# Altium schematic sheet 原理图.SchDoc
size A4; SheetNumber: 0; SheetTotal: 0
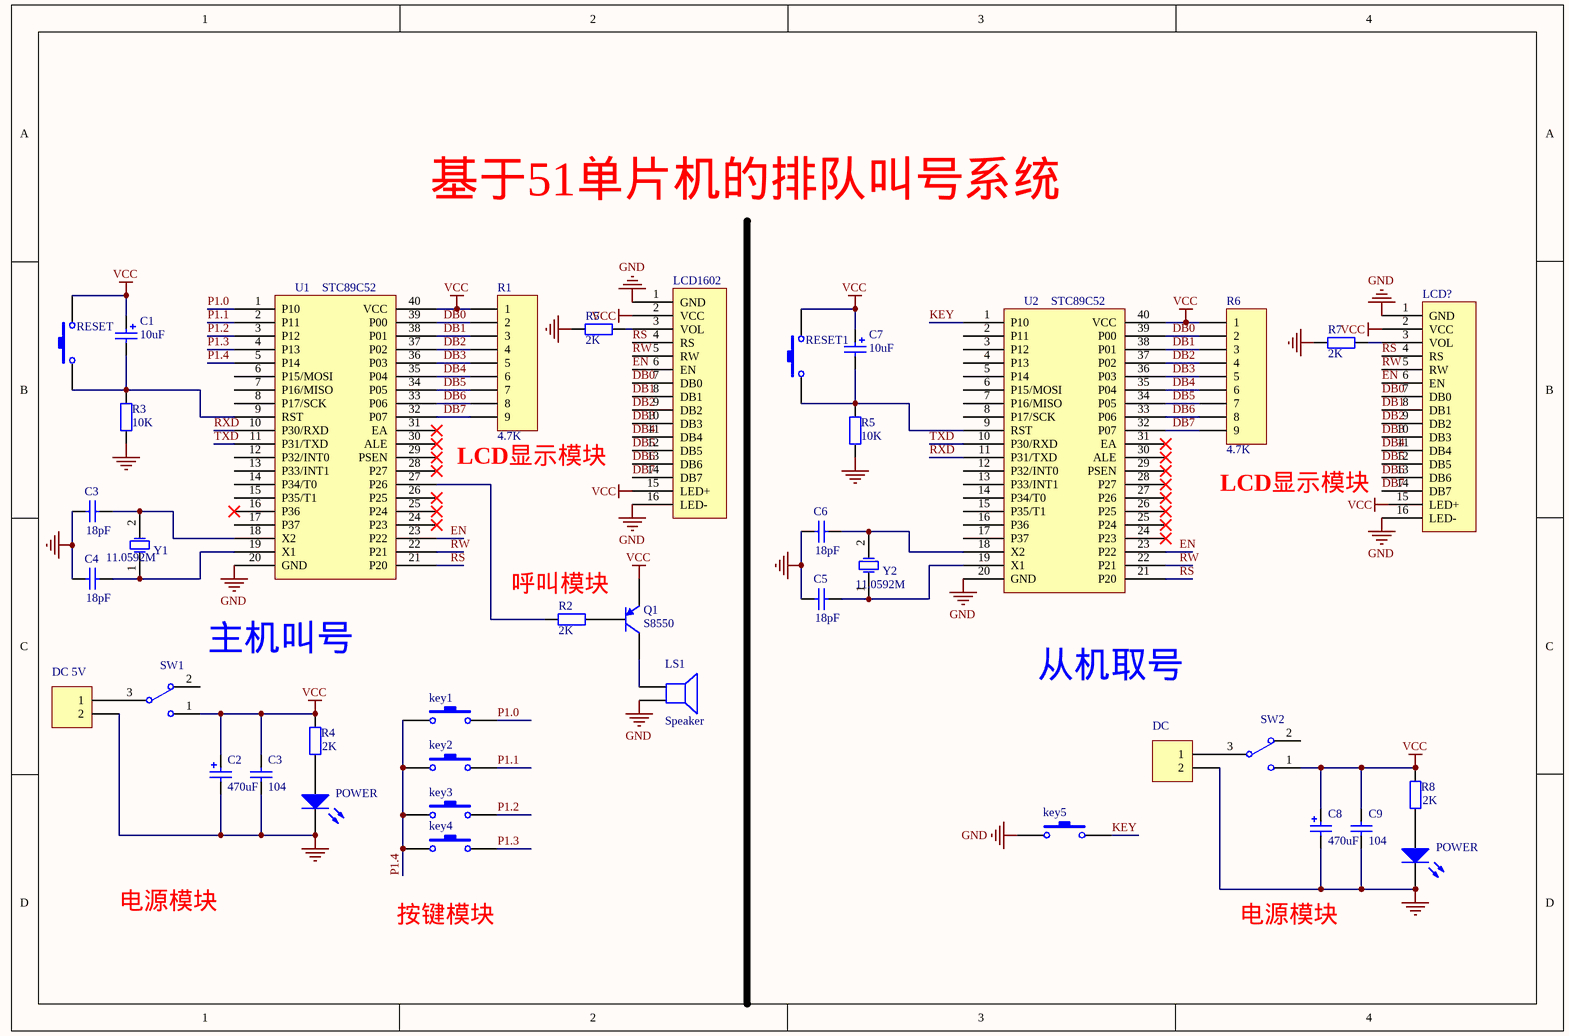
[diagram p0: 原理图.SchDoc]

## Parts
(Parts that share a designator on the sheet are numbered #1, #2 ... from top to bottom, then left to right.)
C1  10uF  [C10UF]
C2  470uF  [C470UF]
C3#1  18pF  [C0.1UF]
C3#2  104  [C0.1UF]
C4  18pF  [C0.1UF]
C5  18pF  [C0.1UF]
C6  18pF  [C0.1UF]
C7  10uF  [C10UF]
C8  470uF  [C470UF]
C9  104  [C0.1UF]
DC  Header 2  [HDR1X2]  (value not drawn)
DC_5V  Header 2  [HDR1X2]  (value not drawn)
key1  SW-PB  [KEY-DIP]  (value not drawn)
key2  SW-PB  [KEY-DIP]  (value not drawn)
key3  SW-PB  [KEY-DIP]  (value not drawn)
key4  SW-PB  [KEY-DIP]  (value not drawn)
key5  SW-PB  [KEY-DIP]  (value not drawn)
LCD1602  LCD1602  [LCD1602]  (value not drawn)
LCD?  LCD1602  [LCD1602]  (value not drawn)
LS1  Speaker  [PIN2]
POWER#1  SI3317-H  [LED-R]  (value not drawn)
POWER#2  SI3317-H  [LED-R]  (value not drawn)
Q1  S8550  [PNP-NPN]
R1  4.7K  [HDR1X9]
R2  value 2K  [AXIAL0.3]  (hidden comment: 470)
R3  10K  [AXIAL0.3]
R4  value 2K  [AXIAL0.3]  (hidden comment: 470)
R5#1  value 2K  [AXIAL0.3]  (hidden comment: 470)
R5#2  10K  [AXIAL0.3]
R6  4.7K  [HDR1X9]
R7  value 2K  [AXIAL0.3]  (hidden comment: 470)
R8  value 2K  [AXIAL0.3]  (hidden comment: 470)
RESET  SW-PB  [KEY-DIP]  (value not drawn)
RESET1  SW-PB  [KEY-DIP]  (value not drawn)
SW1  SW-SPDT  [SW-6]  (value not drawn)
SW2  SW-SPDT  [SW-6]  (value not drawn)
U1  STC89C52  [DIP40]
U2  STC89C52  [DIP40]
Y1  11.0592M  [YDIP]
Y2  11.0592M  [YDIP]

## Nets
GND: C2.1 C3#1.2 C3#2.1 C4.2 C5.2 C6.2 C8.1 C9.1 DC.2 DC_5V.2 key5.1 LCD1602.1(GND) LCD1602.16(LED-) LCD?.1(GND) LCD?.16(LED-) LS1.2 POWER#1.1(K) POWER#2.1(K) R3.1 R5#1.2 R5#2.1 R7.2 U1.20(GND) U2.20(GND)
VCC: C1.2 C2.2 C3#2.2 C7.2 C8.2 C9.2 LCD1602.2(VCC) LCD1602.15(LED+) LCD?.2(VCC) Q1.1(E) R1.1 R4.2 R6.1 R8.2 RESET.2 RESET1.2 SW1.1 SW2.1 U1.40(VCC) U2.40(VCC)
DB0: LCD1602.7(DB0) LCD?.7(DB0) R1.2 R6.2 U1.39(P00) U2.39(P00)
DB1: LCD1602.8(DB1) LCD?.8(DB1) R1.3 R6.3 U1.38(P01) U2.38(P01)
DB2: LCD1602.9(DB2) LCD?.9(DB2) R1.4 R6.4 U1.37(P02) U2.37(P02)
DB3: LCD1602.10(DB3) LCD?.10(DB3) R1.5 R6.5 U1.36(P03) U2.36(P03)
DB4: LCD1602.11(DB4) LCD?.11(DB4) R1.6 R6.6 U1.35(P04) U2.35(P04)
DB5: LCD1602.12(DB5) LCD?.12(DB5) R1.7 R6.7 U1.34(P05) U2.34(P05)
DB6: LCD1602.13(DB6) LCD?.13(DB6) R1.8 R6.8 U1.33(P06) U2.33(P06)
DB7: LCD1602.14(DB7) LCD?.14(DB7) R1.9 R6.9 U1.32(P07) U2.32(P07)
EN: LCD1602.6(EN) LCD?.6(EN) U1.23(P22) U2.23(P22)
KEY: key5.2 U2.1(P10)
P1.0: key1.2 U1.1(P10)
P1.1: key2.2 U1.2(P11)
P1.2: key3.2 U1.3(P12)
P1.3: key4.2 U1.4(P13)
P1.4: key1.1 key2.1 key3.1 key4.1 U1.5(P14)
RS: LCD1602.4(RS) LCD?.4(RS) U1.21(P20) U2.21(P20)
RW: LCD1602.5(RW) LCD?.5(RW) U1.22(P21) U2.22(P21)
RXD: U1.10(P30/RXD) U2.11(P31/TXD)
TXD: U1.11(P31/TXD) U2.10(P30/RXD)
NetC1_1: C1.1 R3.2 RESET.1 U1.9(RST)
NetC3#1_1: C3#1.1 U1.18(X2) Y1.2(OSC2)
NetC4_1: C4.1 U1.19(X1) Y1.1(OSC1)
NetC5_1: C5.1 U2.19(X1) Y2.1(OSC1)
NetC6_1: C6.1 U2.18(X2) Y2.2(OSC2)
NetC7_1: C7.1 R5#2.2 RESET1.1 U2.9(RST)
NetDC_1: DC.1 SW2.3
NetDC_5V_1: DC_5V.1 SW1.3
NetLCD1602_3: LCD1602.3(VOL) R5#1.1
NetLCD?_3: LCD?.3(VOL) R7.1
NetLS1_1: LS1.1 Q1.3(C)
NetPOWER#1_2: POWER#1.2(A) R4.1
NetPOWER#2_2: POWER#2.2(A) R8.1
NetQ1_2: Q1.2(B) R2.1
NetR2_2: R2.2 U1.27(P26)

Not connected (* = marked no-connect by the designer): LCD? 15(LED+); SW1 2; SW2 2; U1 6(P15/MOSI) 7(P16/MISO) 8(P17/SCK) 12(P32/INT0) 13(P33/INT1) 14(P34/T0) 15(P35/T1) 16(P36)* 17(P37) 24(P23)* 25(P24)* 26(P25)* 28(P27)* 29(PSEN)* 30(ALE)* 31(EA)*; U2 2(P11) 3(P12) 4(P13) 5(P14) 6(P15/MOSI) 7(P16/MISO) 8(P17/SCK) 12(P32/INT0) 13(P33/INT1) 14(P34/T0) 15(P35/T1) 16(P36) 17(P37) 24(P23)* 25(P24)* 26(P25)* 27(P26)* 28(P27)* 29(PSEN)* 30(ALE)* 31(EA)*

## Notes on the sheet
- 基于51单片机的排队叫号系统
- (near R1) LCD显示模块
- (near R6) LCD显示模块
- 主机叫号
- (near R2) 呼叫模块
- 从机取号
- 电源模块
- 按键模块
- Labels drawn without touching a wire or pin: VCC

## Library data of the parts
C1 C2 C7 C8 = Cap Pol2: Polarized Capacitor (Axial); Published: 8-Jun-2000; LatestRevisionDate: 17-Jul-2002; LatestRevisionNote: Re-released for DXP Platform.; PackageReference: POLAR0.8; Publisher: Altium Limited
  C1 C7: Value: 10uF
  C2 C8: Value: 470uF
C3#1 C3#2 C4-C6 C9 = Cap: Capacitor; Published: 8-Jun-2000; LatestRevisionDate: 17-Jul-2002; LatestRevisionNote: Re-released for DXP Platform.; PackageReference: RAD-0.3; Publisher: Altium Limited
  C3#1 C4-C6: Value: 18pF
  C3#2 C9: Value: 104
DC DC_5V = Header 2: Header, 2-Pin; LatestRevisionDate: 17-Jul-2002; LatestRevisionNote: Re-released for DXP Platform.; Publisher: Altium Limited
key1-key5 RESET RESET1 = SW-PB: Switch; Published: 24-Mar-1999; LatestRevisionDate: 17-Jul-2002; LatestRevisionNote: Re-released for DXP Platform.; PackageReference: SPST-2; Publisher: Altium Limited
LS1 = Speaker: Loudspeaker; Published: 24-Mar-1999; LatestRevisionDate: 17-Jul-2002; LatestRevisionNote: Re-released for DXP Platform.; PackageReference: PIN2; Publisher: Altium Limited
POWER#1 POWER#2 = LED0: Typical INFRARED GaAs LED; Published: 8-Jun-2000; LatestRevisionDate: 08-Jul-2005; LatestRevisionNote: Mech Layer 1 removed.; PackageReference: LED-0; Publisher: Altium Limited
Q1 = 2N3906: PNP General Purpose Amplifier; Published: 8-Jun-2000; LatestRevisionDate: 15-Jan-2003; LatestRevisionNote: PCB Footprint 'BCY-W3/D4.7' replaced; DatasheetVersion: 1997; PackageVersion: Sep-1998; PackageReference: TO-92A; Publisher: Altium Limited; Code_JEDEC: TO-92A; ComponentLink1Description: Manufacturer Link; ComponentLink1URL: http://www.fairchildsemi.com/; ComponentLink2Description: Datasheet; ComponentLink2URL: http://www.fairchildsemi.com/ds/2N%2F2N3906.pdf
R1 R6 = Header 9: Header, 9-Pin; LatestRevisionDate: 17-Jul-2002; LatestRevisionNote: Re-released for DXP Platform.; Publisher: Altium Limited
R2 R3 R5#1 R5#2 R7 = 0805: Resistor; Published: 8-Jun-2000; LatestRevisionDate: 17-Jul-2002; LatestRevisionNote: Re-released for DXP Platform.; PackageReference: AXIAL-0.4; Publisher: Altium Limited
  R3 R5#2: Value: 10K
R4 R8 = Res2: Resistor; Published: 8-Jun-2000; LatestRevisionDate: 17-Jul-2002; LatestRevisionNote: Re-released for DXP Platform.; PackageReference: AXIAL-0.4; Publisher: Altium Limited
SW1 SW2 = SW-SPDT: SPDT Subminiature Toggle Switch, Right Angle Mounting, Vertical Actuation; Published: 24-Mar-1999; LatestRevisionDate: 17-Dec-2003; LatestRevisionNote: Schematic revised, PCB Footprint replaced.; DatasheetVersion: 05-Dec-2000; PackageReference: TL36WW15050; Publisher: Altium Limited; ComponentLink1Description: Manufacturer Link; ComponentLink1URL: http://www.apem.com
U1 U2 = AT89S52
Y1 Y2 = XTAL: Crystal Oscillator; Published: 8-Jun-2000; LatestRevisionDate: 17-Jul-2002; LatestRevisionNote: Re-released for DXP Platform.; PackageReference: R38; Publisher: Altium Limited